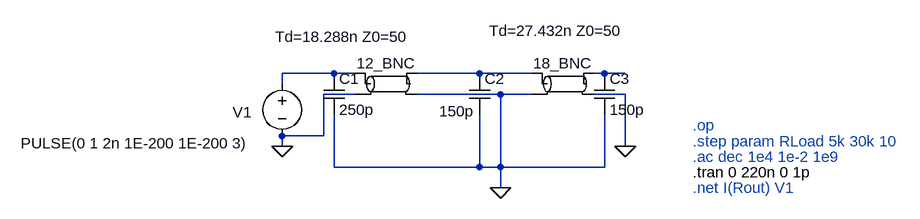
[diagram p0: schematic 2a_matched.asc]
2a_matched.asc, the LTspice schematic file:
Version 4.1
SHEET 1 1168 680
WIRE 272 432 192 432
WIRE 304 432 272 432
WIRE 496 432 400 432
WIRE 576 432 496 432
WIRE 688 432 672 432
WIRE 720 432 688 432
WIRE 192 448 192 432
WIRE 304 464 256 464
WIRE 528 464 400 464
WIRE 576 464 528 464
WIRE 720 464 672 464
WIRE 256 528 256 464
WIRE 256 528 192 528
WIRE 192 544 192 528
WIRE 720 544 720 464
WIRE 272 576 272 496
WIRE 496 576 496 496
WIRE 496 576 272 576
WIRE 528 576 528 464
WIRE 528 576 496 576
WIRE 688 576 688 496
WIRE 688 576 528 576
WIRE 528 608 528 576
FLAG 528 608 0
FLAG 192 544 0
FLAG 720 544 0
SYMBOL tline 352 448 R0
WINDOW 3 -67 -88 Top 2
SYMATTR Value Td=18.288n Z0=50
SYMATTR InstName 12_BNC
SYMBOL Voltage 192 432 R0
WINDOW 3 -402 107 Left 2
WINDOW 0 -76 60 Left 2
SYMATTR Value PULSE(0 1 2n 1E-200 1E-200 3)
SYMATTR InstName V1
SYMATTR SpiceLine Rser=50
SYMBOL tline 624 448 R0
WINDOW 3 -10 -97 Top 2
SYMATTR Value Td=27.432n Z0=50
SYMATTR InstName 18_BNC
SYMBOL cap 256 432 R0
SYMATTR InstName C1
SYMATTR Value 250p
SYMATTR SpiceLine Rser=5m
SYMBOL cap 480 432 R0
WINDOW 3 -46 58 Left 2
SYMATTR Value 150p
SYMATTR InstName C2
SYMATTR SpiceLine Rser=5m Lser=10n
SYMBOL cap 672 432 R0
SYMATTR InstName C3
SYMATTR Value 150p
TEXT 824 512 Left 2 ;.op
TEXT 824 536 Left 2 ;.step param RLoad 5k 30k 10
TEXT 824 560 Left 2 ;.ac dec 1e4 1e-2 1e9
TEXT 824 584 Left 2 !.tran 0 220n 0 1p
TEXT 824 608 Left 2 ;.net I(Rout) V1

The netlist it stands for:
* 2a_matched.asc
T§12_BNC N001 0 N002 0 Td=18.288n Z0=50
V1 N001 0 PULSE(0 1 2n 1E-200 1E-200 3) Rser=50
T§18_BNC N002 0 N003 0 Td=27.432n Z0=50
C1 N001 0 250p Rser=5m
C2 N002 0 150p Rser=5m Lser=10n
C3 N003 0 150p
* .op
* .step param RLoad 5k 30k 10
* .ac dec 1e4 1e-2 1e9
.tran 0 220n 0 1p
* .net I(Rout) V1
.backanno
.end